# Altium project LPCB227__RLOOP__REMOTE_ACCEL.PrjPCB
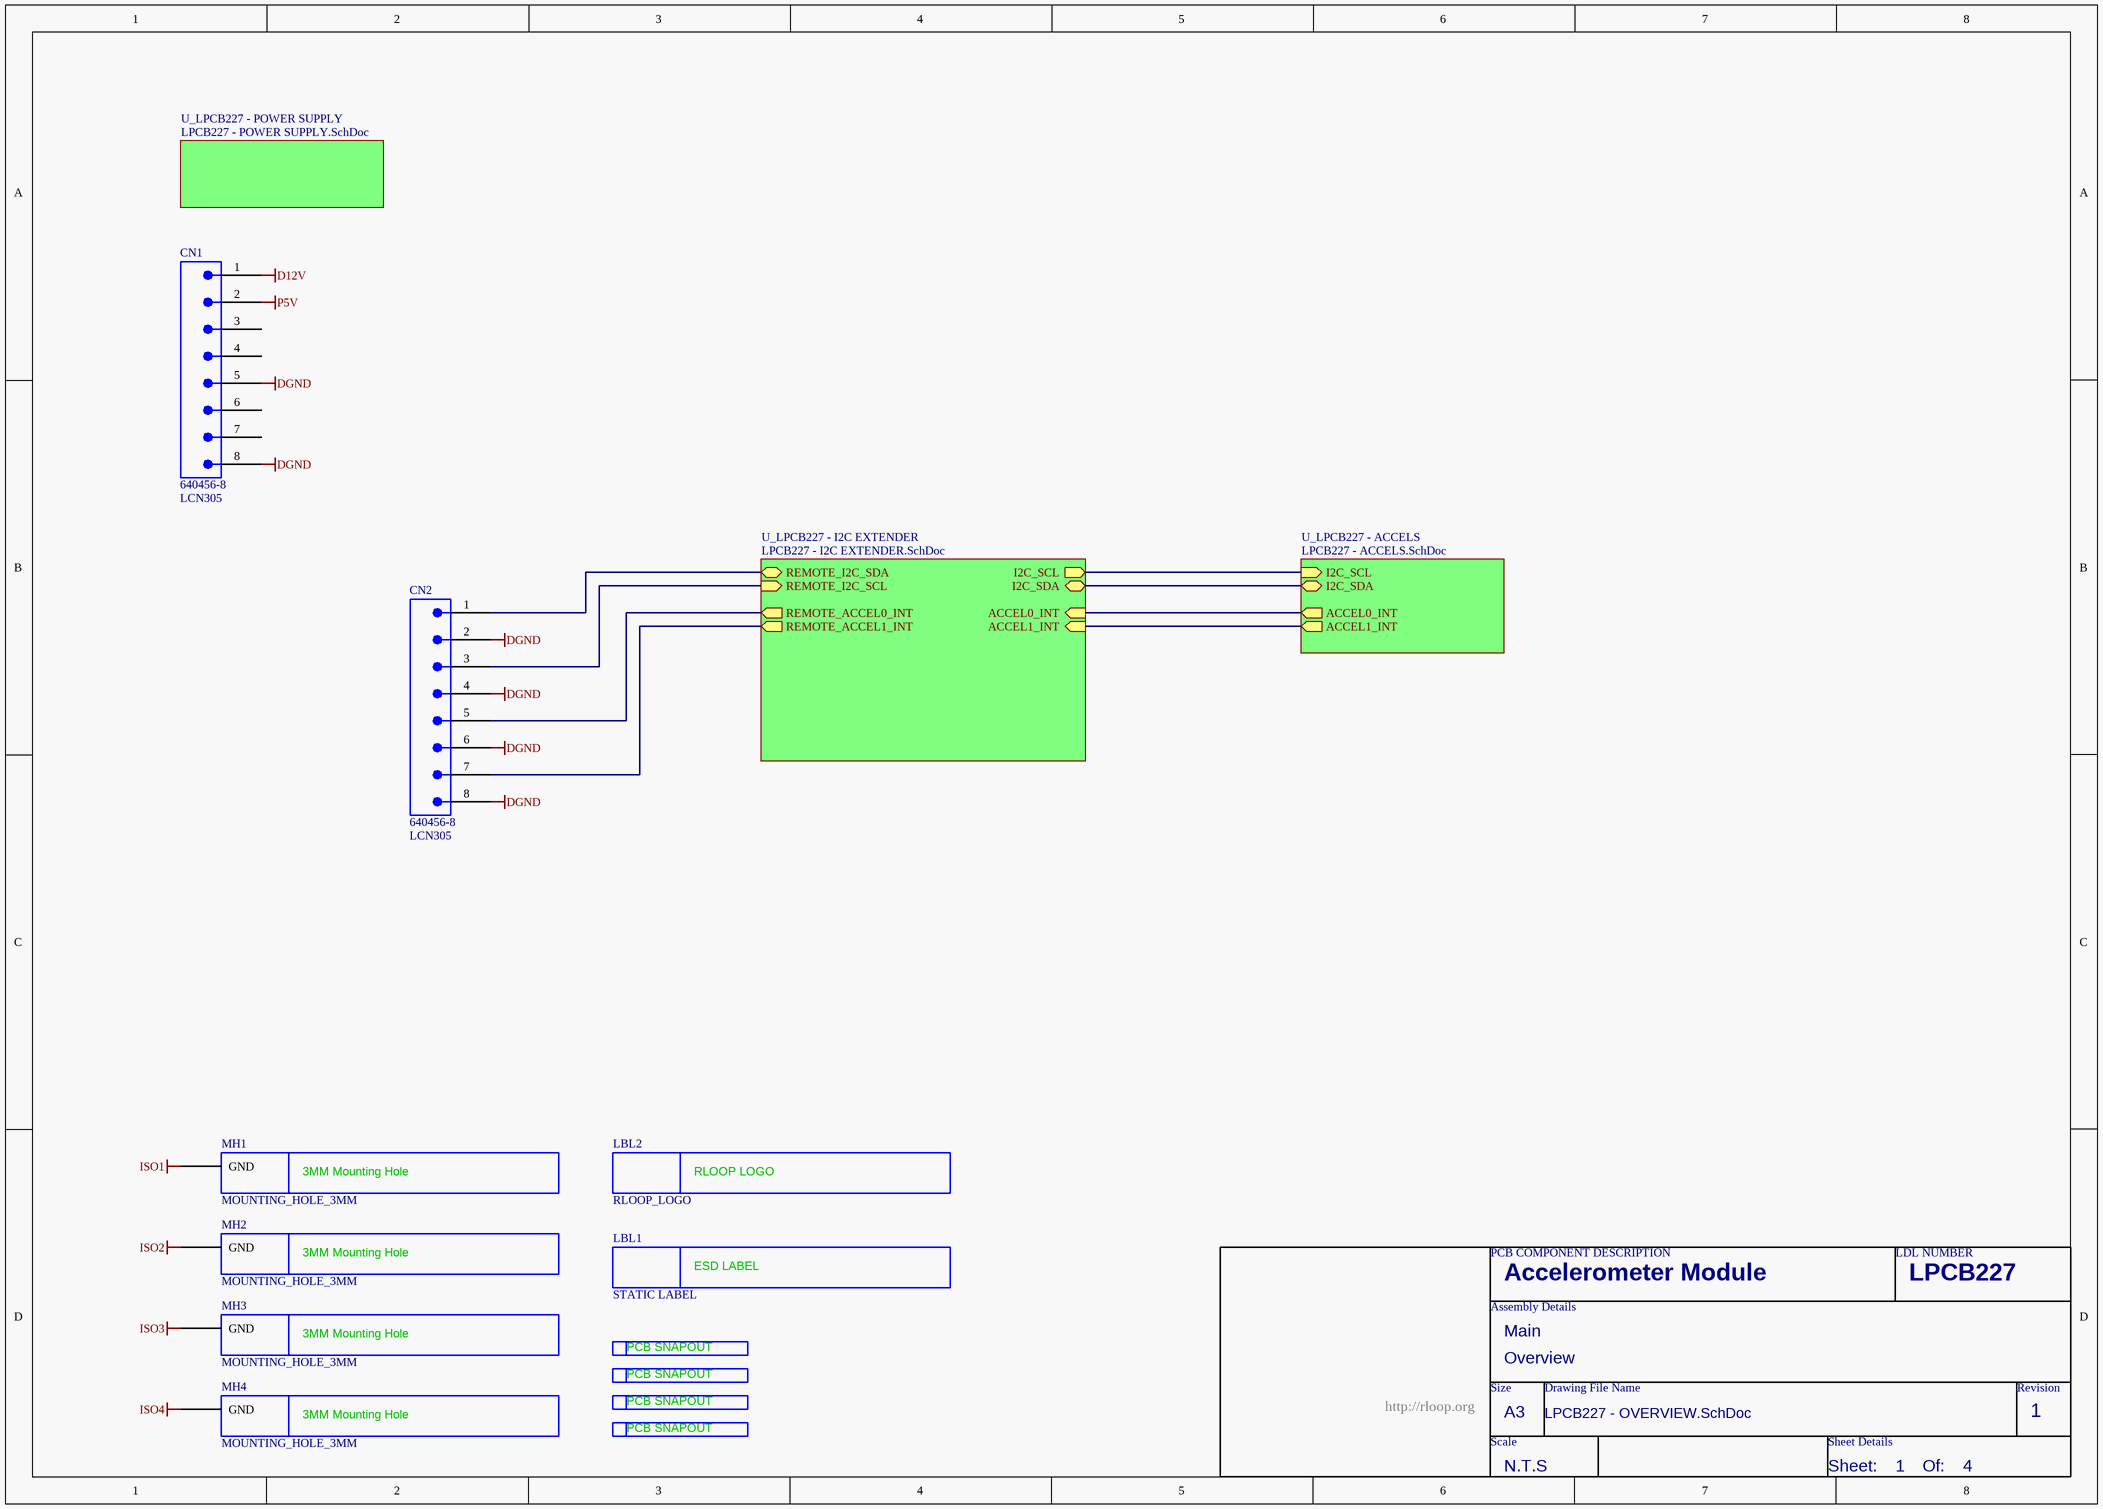
[diagram p0: LPCB227 - OVERVIEW.SchDoc]
4 sheets, 39 parts. Net scope: hierarchical (ports join the sheet entries above them; power ports are global).
Board files: LPCB227R0.PcbDoc, LPCB227R0__ASCII.PcbDoc
Sheets:
  LPCB227 - OVERVIEW.SchDoc
    U_LPCB227 - ACCELS = LPCB227 - ACCELS.SchDoc
    U_LPCB227 - POWER SUPPLY = LPCB227 - POWER SUPPLY.SchDoc
    U_LPCB227 - I2C EXTENDER = LPCB227 - I2C EXTENDER.SchDoc

## Sheet LPCB227 - OVERVIEW.SchDoc
size A3; Address1: Factory 10; Address2: 9-13 Dingley Avenue, Dandeong, VICTORIA 3175, AUSTRALIA; DocumentNumber: 1; Revision: 1; SheetNumber: 1; SheetTotal: 4; Lockie__PCB_SUB_ASSEMBLY: Overview; Lockie__PCB_ASSEMBLY: Main; Lockie__LDL: LPCB227; Lockie__PCB_DESCRIPTION: Accelerometer Module

### Parts
CN1  640456-8  LDL_NUMBER: LCN305  [640456-8]
CN2  640456-8  LDL_NUMBER: LCN305  [640456-8]
LBL1  STATIC LABEL  [STATIC_LABEL]  (no BOM)
LBL2  RLOOP_LOGO  [RLOOP_LOGO]  (no BOM)
MH1  MOUNTING_HOLE_3MM  [MOUNTING_HOLE_3MM]  (no BOM)
MH2  MOUNTING_HOLE_3MM  [MOUNTING_HOLE_3MM]  (no BOM)
MH3  MOUNTING_HOLE_3MM  [MOUNTING_HOLE_3MM]  (no BOM)
MH4  MOUNTING_HOLE_3MM  [MOUNTING_HOLE_3MM]  (no BOM)
SN1  PCB_SNAPOUT  [SNAPOUT_NEW]  (value not drawn)  (no BOM)
SN2  PCB_SNAPOUT  [SNAPOUT_NEW]  (value not drawn)  (no BOM)
SN3  PCB_SNAPOUT  [SNAPOUT_NEW]  (value not drawn)  (no BOM)
SN4  PCB_SNAPOUT  [SNAPOUT_NEW]  (value not drawn)  (no BOM)

### Sub-sheets
U_LPCB227 - ACCELS = LPCB227 - ACCELS.SchDoc: I2C_SCL (in), I2C_SDA (bidir), ACCEL0_INT (out), ACCEL1_INT (out)
U_LPCB227 - I2C EXTENDER = LPCB227 - I2C EXTENDER.SchDoc: REMOTE_I2C_SDA (bidir), REMOTE_I2C_SCL (in), I2C_SCL (out), I2C_SDA (bidir), ACCEL0_INT (in), ACCEL1_INT (in), REMOTE_ACCEL0_INT (out), REMOTE_ACCEL1_INT (out)
U_LPCB227 - POWER SUPPLY = LPCB227 - POWER SUPPLY.SchDoc: no entries

### Nets
D12V: CN1.1
DGND: CN1.5 CN1.8 CN2.2 CN2.4 CN2.6 CN2.8
ISO1: MH1.MOUNT(GND)
ISO2: MH2.MOUNT(GND)
ISO3: MH3.MOUNT(GND)
ISO4: MH4.MOUNT(GND)
P5V: CN1.2
I2C_SCL: sheet U_LPCB227 - ACCELS/I2C_SCL, sheet U_LPCB227 - I2C EXTENDER/I2C_SCL
I2C_SDA: sheet U_LPCB227 - ACCELS/I2C_SDA, sheet U_LPCB227 - I2C EXTENDER/I2C_SDA
NetCN2_1: CN2.1 ; sheet U_LPCB227 - I2C EXTENDER/REMOTE_I2C_SDA
NetCN2_3: CN2.3 ; sheet U_LPCB227 - I2C EXTENDER/REMOTE_I2C_SCL
NetCN2_5: CN2.5 ; sheet U_LPCB227 - I2C EXTENDER/REMOTE_ACCEL0_INT
NetCN2_7: CN2.7 ; sheet U_LPCB227 - I2C EXTENDER/REMOTE_ACCEL1_INT
NetIC1_11: sheet U_LPCB227 - ACCELS/ACCEL0_INT, sheet U_LPCB227 - I2C EXTENDER/ACCEL0_INT
NetIC2_11: sheet U_LPCB227 - ACCELS/ACCEL1_INT, sheet U_LPCB227 - I2C EXTENDER/ACCEL1_INT

Not connected (* = marked no-connect by the designer): CN1 3 4 6 7

### Notes on the sheet
- PCB COMPONENT DESCRIPTION
- LDL NUMBER
- Assembly Details
- Size
- Drawing File Name
- Revision
- http://rloop.org
- Scale
- A3
- Sheet Details
- N.T.S
- Sheet:
- Of:
- (in symbol MOUNTING_HOLE_3MM) 3MM Mounting Hole
- (in symbol PCB_SNAPOUT) PCB SNAPOUT
- (in symbol RLOOP_LOGO) RLOOP LOGO
- (in symbol STATIC LABEL) ESD LABEL

### Library data of the parts
CN1 CN2 = 640456-8: Connector, Male Header, 8 Way; FMEDA__CHANNEL: COM; FMEDA__OPERATING__CURRENT_MAX: 0; FMEDA__OPERATING__TEMP_MAX: 50; FMEDA__OPERATING__TEMP_MIN: -20; FMEDA__OPERATING__TEMP_TYP: 27; FMEDA__OPERATING__VOLTAGE_MAX: 16; FMEDA__OPERATING__VOLTAGE_TYP: 12; FMEDA__FUNCTION_IN_SYSTEM: *; FMEDA__OPERATING__CURRENT_MIN: 0; FMEDA__OPERATING__CURRENT_TYP: 0; FMEDA__OPERATING__VOLTAGE_MIN: 0
LBL1 = STATIC LABEL: FMEDA__CHANNEL: DIAG; FMEDA__FUNCTION_IN_SYSTEM: *
LBL2 = RLOOP_LOGO: FMEDA__CHANNEL: DIAG; FMEDA__FUNCTION_IN_SYSTEM: *
MH1-MH4 = MOUNTING_HOLE_3MM: 3MM Mouting Hole; FMEDA__CHANNEL: DIAG; FMEDA__FUNCTION_IN_SYSTEM: *
SN1-SN4 = PCB_SNAPOUT: FMEDA__CHANNEL: DIAG; FMEDA__FUNCTION_IN_SYSTEM: *

## Sheet LPCB227 - ACCELS.SchDoc
size A3; Address1: Factory 10; Address2: 9-13 Dingley Avenue, Dandeong, VICTORIA 3175, AUSTRALIA; DocumentNumber: 2; Revision: 1; SheetNumber: 2; SheetTotal: 4; Lockie__PCB_SUB_ASSEMBLY: Accelerometers; Lockie__PCB_ASSEMBLY: Main; Lockie__LDL: LPCB227; Lockie__PCB_DESCRIPTION: Accelerometer Module
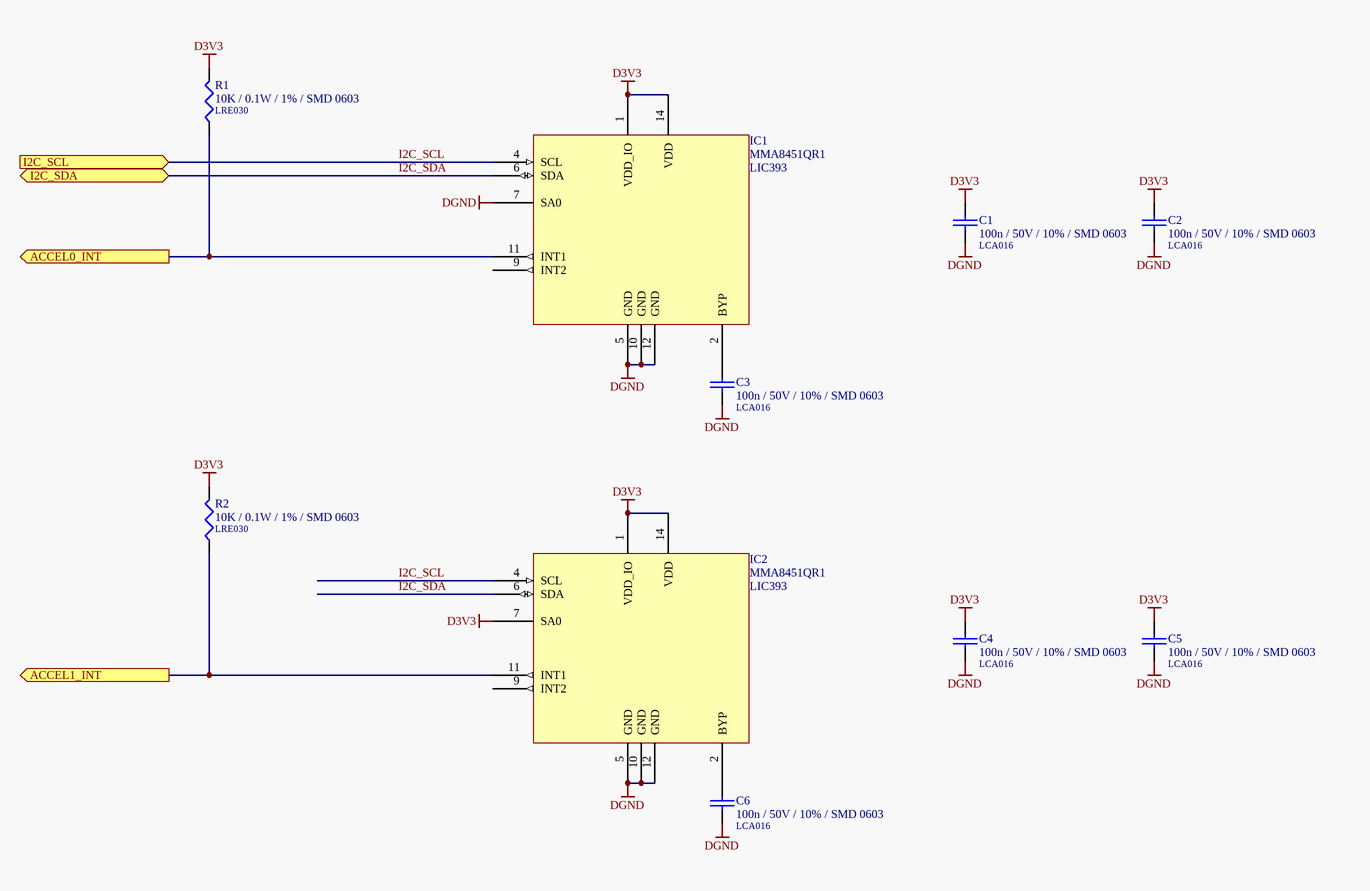
[diagram p1: LPCB227 - ACCELS.SchDoc]

### Parts
C1  100n / 50V / 10% / SMD 0603  LDL_NUMBER: LCA016  [LFP011__CC1608-0603-IPC7351_B]
C2  100n / 50V / 10% / SMD 0603  LDL_NUMBER: LCA016  [LFP011__CC1608-0603-IPC7351_B]
C3  100n / 50V / 10% / SMD 0603  LDL_NUMBER: LCA016  [LFP011__CC1608-0603-IPC7351_B]
C4  100n / 50V / 10% / SMD 0603  LDL_NUMBER: LCA016  [LFP011__CC1608-0603-IPC7351_B]
C5  100n / 50V / 10% / SMD 0603  LDL_NUMBER: LCA016  [LFP011__CC1608-0603-IPC7351_B]
C6  100n / 50V / 10% / SMD 0603  LDL_NUMBER: LCA016  [LFP011__CC1608-0603-IPC7351_B]
IC1  MMA8451QR1  LDL_NUMBER: LIC393  [LFP051__QFN16]
IC2  MMA8451QR1  LDL_NUMBER: LIC393  [LFP051__QFN16]
R1  10K / 0.1W / 1% / SMD 0603  LDL_NUMBER: LRE030  [LFP020__CR1608-0603-IPC7351_B]
R2  10K / 0.1W / 1% / SMD 0603  LDL_NUMBER: LRE030  [LFP020__CR1608-0603-IPC7351_B]

### Ports
ACCEL0_INT (out), ACCEL1_INT (out), I2C_SCL (in), I2C_SDA (bidir)

### Nets
D3V3: C1.1 C2.1 C4.1 C5.1 IC1.1(VDD_IO) IC1.14(VDD) IC2.1(VDD_IO) IC2.7(SA0) IC2.14(VDD) R1.2 R2.2
DGND: C1.2 C2.2 C3.2 C4.2 C5.2 C6.2 IC1.5(GND) IC1.7(SA0) IC1.10(GND) IC1.12(GND) IC2.5(GND) IC2.10(GND) IC2.12(GND)
I2C_SCL: IC1.4(SCL) IC2.4(SCL) ; port I2C_SCL
I2C_SDA: IC1.6(SDA) IC2.6(SDA) ; port I2C_SDA
NetC3_1: C3.1 IC1.2(BYP)
NetC6_1: C6.1 IC2.2(BYP)
NetIC1_11: IC1.11(INT1) R1.1 ; port ACCEL0_INT
NetIC2_11: IC2.11(INT1) R2.1 ; port ACCEL1_INT

Not connected (* = marked no-connect by the designer): IC1 9(INT2); IC2 9(INT2)

### Notes on the sheet
- PCB COMPONENT DESCRIPTION
- LDL NUMBER
- Assembly Details
- Size
- Drawing File Name
- Revision
- http://rloop.org
- Scale
- A3
- Sheet Details
- N.T.S
- Sheet:
- Of:

### Library data of the parts
C1-C6 = 100n / 50V / 10% / SMD 0603: Capacitor, Ceramic Chip, 100nF (0.1uF), 50V, 5%, SMD 0603 [LCA016]; FMEDA__OPERATING__VOLTAGE_MIN: 0; FMEDA__OPERATING__VOLTAGE_MAX: 3.3; FMEDA__OPERATING__TEMP_MIN: -20; FMEDA__OPERATING__TEMP_TYP: 27; FMEDA__OPERATING__TEMP_MAX: 50; FMEDA__CHANNEL: COM; Value: 100n; FMEDA__FUNCTION_IN_SYSTEM: *; FMEDA__OPERATING__VOLTAGE_TYP: 3.3
IC1 IC2 = MMA8451QR1: IC, Accelerometer, 3-Axis, 3.3V, I2C, SMD QFN16 [LIC393]; FMEDA__OPERATING__TEMP_MAX: 50; FMEDA__OPERATING__TEMP_MIN: -20; FMEDA__OPERATING__TEMP_TYP: 27; FMEDA__OPERATING__VOLTAGE_MAX: 3.3; FMEDA__OPERATING__VOLTAGE_MIN: 0; FMEDA__CHANNEL: COM; FMEDA__OPERATING__VOLTAGE_TYP: 3.3; FMEDA__FUNCTION_IN_SYSTEM: *
R1 R2 = 10K / 0.1W / 1% / SMD 0603: Resistor, Ceramic Chip, 10K, 0.1W, 1%, SMD 0603 [LRE030]; FMEDA__OPERATING__POWER_MAX: 0; FMEDA__OPERATING__TEMP_MAX: 50; FMEDA__OPERATING__TEMP_MIN: -20; FMEDA__OPERATING__TEMP_TYP: 27; FMEDA__CHANNEL: COM; Value: 10K; FMEDA__OPERATING__POWER_MIN: 0; FMEDA__OPERATING__VOLTAGE_MAX: 0; FMEDA__OPERATING__VOLTAGE_MIN: 0; FMEDA__OPERATING__VOLTAGE_TYP: 0; FMEDA__FUNCTION_IN_SYSTEM: *

## Sheet LPCB227 - POWER SUPPLY.SchDoc
size A3; Address1: Factory 10; Address2: 9-13 Dingley Avenue, Dandeong, VICTORIA 3175, AUSTRALIA; DocumentNumber: 4; Revision: 1; SheetNumber: 4; SheetTotal: 4; Lockie__PCB_SUB_ASSEMBLY: Power Supply; Lockie__PCB_ASSEMBLY: Main; Lockie__LDL: LPCB227; Lockie__PCB_DESCRIPTION: Accelerometer Module
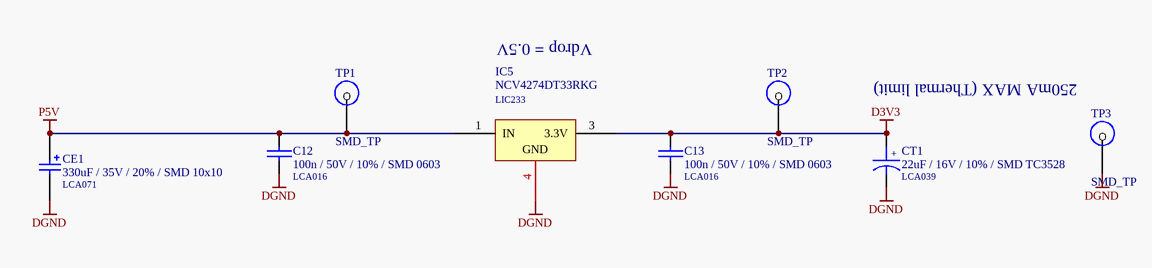
[diagram p2: LPCB227 - POWER SUPPLY.SchDoc]

### Parts
C12  100n / 50V / 10% / SMD 0603  LDL_NUMBER: LCA016  [LFP011__CC1608-0603-IPC7351_B]
C13  100n / 50V / 10% / SMD 0603  LDL_NUMBER: LCA016  [LFP011__CC1608-0603-IPC7351_B]
CE1  330uF / 35V / 20% / SMD 10x10  LDL_NUMBER: LCA071  [LFP041__NICHICON_WT_10X10]
CT1  22uF / 16V / 10% / SMD TC3528  LDL_NUMBER: LCA039  [LFP018__TC3528]
IC5  NCV4274DT33RKG  LDL_NUMBER: LIC233  [LFP019__369A-13]
TP1  SMD_TP  [SMD-TP]  (no BOM)
TP2  SMD_TP  [SMD-TP]  (no BOM)
TP3  SMD_TP  [SMD-TP]  (no BOM)

### Nets
D3V3: C13.1 CT1.1 IC5.3(3.3V) TP2.1
DGND: C12.2 C13.2 CE1.2 CT1.2 IC5.4(GND) TP3.1
P5V: C12.1 CE1.1 IC5.1(IN) TP1.1

### Notes on the sheet
- Vdrop = 0.5V
- 250mA MAX (Thermal limit)
- PCB COMPONENT DESCRIPTION
- LDL NUMBER
- Assembly Details
- Size
- Drawing File Name
- Revision
- http://rloop.org
- Scale
- A3
- Sheet Details
- N.T.S
- Sheet:
- Of:
- (in symbol 22uF / 16V / 10% / SMD TC3528) +

### Library data of the parts
C12 C13 = 100n / 50V / 10% / SMD 0603: as C1 on sheet LPCB227 - ACCELS; Value: 100n; FMEDA__FUNCTION_IN_SYSTEM: *; FMEDA__OPERATING__VOLTAGE_TYP: 3.3
CE1 = 330uF / 35V / 20% / SMD 10x10: Capacitor, Aluminum Electrolytic, 330uF, 35V, 20%, SMD (10mm x 10mm) [LCA071]; FMEDA__OPERATING__TEMP_MAX: 50; FMEDA__OPERATING__TEMP_MIN: -20; FMEDA__OPERATING__TEMP_TYP: 27; FMEDA__OPERATING__VOLTAGE_MAX: 0; Value: 330u; FMEDA__CHANNEL: COM; FMEDA__OPERATING__VOLTAGE_MIN: 0; FMEDA__OPERATING__VOLTAGE_TYP: 0; FMEDA__FUNCTION_IN_SYSTEM: *
CT1 = 22uF / 16V / 10% / SMD TC3528: Capacitor, Tantalum, 22uF, 16V, 10%, SMD TC3528 (BCASE) [LCA039]; Value: 22u; FMEDA__OPERATING__VOLTAGE_MAX: 3.3; FMEDA__OPERATING__VOLTAGE_MIN: 0; FMEDA__OPERATING__TEMP_MAX: 50; FMEDA__OPERATING__TEMP_MIN: -20; FMEDA__OPERATING__TEMP_TYP: 27; FMEDA__CHANNEL: COM; FMEDA__OPERATING__VOLTAGE_TYP: 3.3; FMEDA__FUNCTION_IN_SYSTEM: *
IC5 = NCV4274DT33RKG: IC, Voltage Regulator, 400mA, 3.3V LDO, SMD DPAK [LIC233]; FMEDA__OPERATING__OUTPUT_CURRENT_MIN: 0; FMEDA__OPERATING__TEMP_MAX: 50; FMEDA__OPERATING__TEMP_MIN: -20; FMEDA__OPERATING__TEMP_TYP: 27; VALUE: 0; Note: Obey Thermal Design Rules; FMEDA__CHANNEL: COM; FMEDA__OPERATING__OUTPUT_CURRENT_TYP: 0; FMEDA__OPERATING__VOLTAGE_MAX: 0; FMEDA__OPERATING__VOLTAGE_MIN: 0; FMEDA__OPERATING__VOLTAGE_TYP: 0; FMEDA__FUNCTION_IN_SYSTEM: *
TP1-TP3 = SMD_TP: SMD Test Point; FMEDA__CHANNEL: COM; FMEDA__OPERATING__CURRENT_MAX: 0; FMEDA__OPERATING__TEMP_MAX: 50; FMEDA__OPERATING__TEMP_MIN: -20; FMEDA__OPERATING__TEMP_TYP: 27; FMEDA__OPERATING__VOLTAGE_MAX: 16; FMEDA__OPERATING__VOLTAGE_TYP: 12; FMEDA__OPERATING__CURRENT_MIN: 0; FMEDA__OPERATING__CURRENT_TYP: 0; FMEDA__OPERATING__VOLTAGE_MIN: 0

## Sheet LPCB227 - I2C EXTENDER.SchDoc
size A3; Address1: Factory 10; Address2: 9-13 Dingley Avenue, Dandeong, VICTORIA 3175, AUSTRALIA; DocumentNumber: 3; Revision: 1; SheetNumber: 3; SheetTotal: 4; Lockie__PCB_SUB_ASSEMBLY: Bus Extender; Lockie__PCB_ASSEMBLY: Main; Lockie__LDL: LPCB227; Lockie__PCB_DESCRIPTION: Accelerometer Module
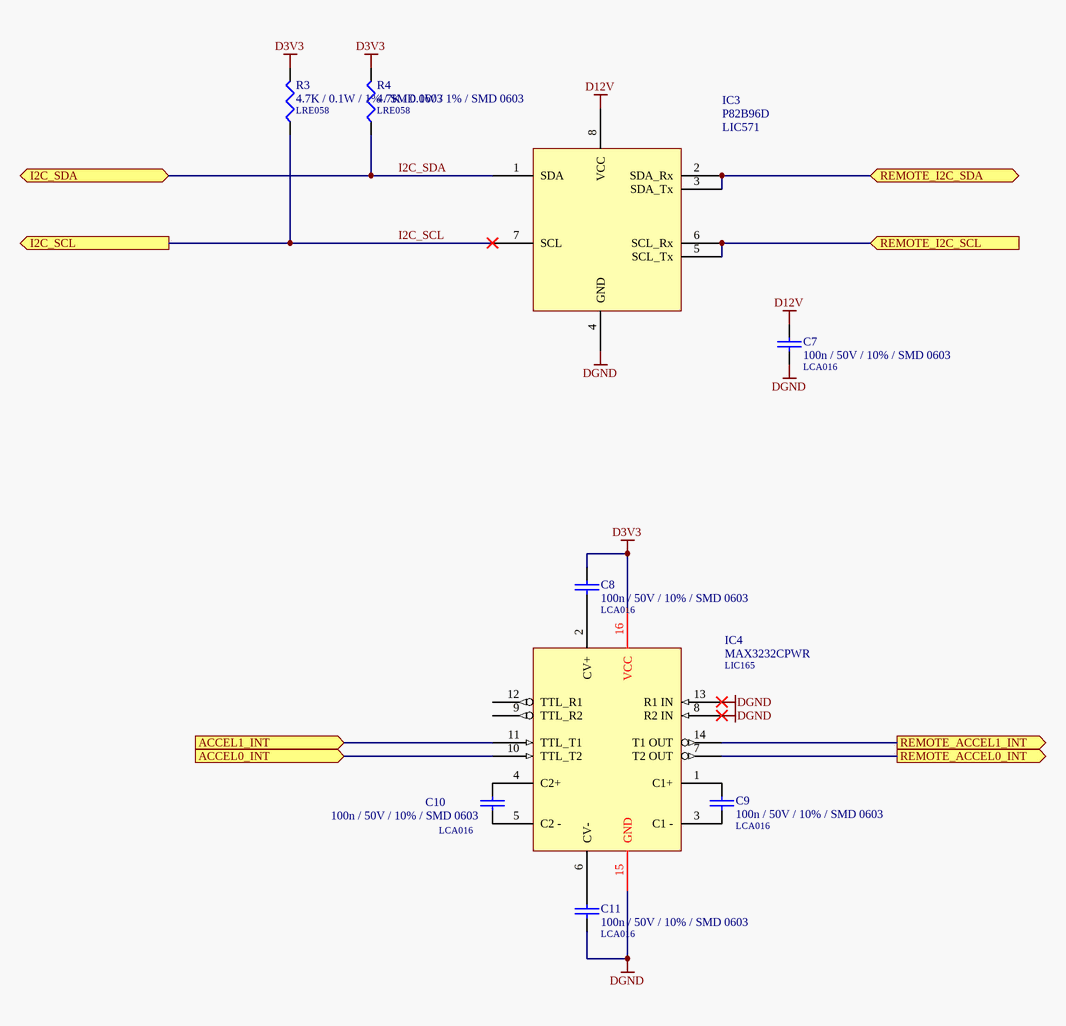
[diagram p3: LPCB227 - I2C EXTENDER.SchDoc]

### Parts
C7  100n / 50V / 10% / SMD 0603  LDL_NUMBER: LCA016  [LFP011__CC1608-0603-IPC7351_B]
C8  100n / 50V / 10% / SMD 0603  LDL_NUMBER: LCA016  [LFP011__CC1608-0603-IPC7351_B]
C9  100n / 50V / 10% / SMD 0603  LDL_NUMBER: LCA016  [LFP011__CC1608-0603-IPC7351_B]
C10  100n / 50V / 10% / SMD 0603  LDL_NUMBER: LCA016  [LFP011__CC1608-0603-IPC7351_B]
C11  100n / 50V / 10% / SMD 0603  LDL_NUMBER: LCA016  [LFP011__CC1608-0603-IPC7351_B]
IC3  P82B96D  LDL_NUMBER: LIC571  [LFP097__SOIC150-8]
IC4  MAX3232CPWR  LDL_NUMBER: LIC165  [LFP049__TSSOP-16]
R3  4.7K / 0.1W / 1% / SMD 0603  LDL_NUMBER: LRE058  [LFP020__CR1608-0603-IPC7351_B]
R4  4.7K / 0.1W / 1% / SMD 0603  LDL_NUMBER: LRE058  [LFP020__CR1608-0603-IPC7351_B]

### Ports
ACCEL0_INT (in), ACCEL1_INT (in), I2C_SCL (out), I2C_SDA (bidir), REMOTE_ACCEL0_INT (out), REMOTE_ACCEL1_INT (out), REMOTE_I2C_SCL (in), REMOTE_I2C_SDA (bidir)

### Nets
D3V3: C8.1 IC4.16(VCC) R3.2 R4.2
D12V: C7.1 IC3.8(VCC)
DGND: C7.2 C11.2 IC3.4(GND) IC4.8(R2_IN) IC4.13(R1_IN) IC4.15(GND)
I2C_SCL: IC3.7(SCL) R3.1 ; port I2C_SCL
I2C_SDA: IC3.1(SDA) R4.1 ; port I2C_SDA
NetC8_2: C8.2 IC4.2(CV+)
NetC9_1: C9.1 IC4.1(C1+)
NetC9_2: C9.2 IC4.3(C1_-)
NetC10_1: C10.1 IC4.4(C2+)
NetC10_2: C10.2 IC4.5(C2_-)
NetC11_1: C11.1 IC4.6(CV-)
NetCN2_1: IC3.2(SDA_Rx) IC3.3(SDA_Tx) ; port REMOTE_I2C_SDA
NetCN2_3: IC3.5(SCL_Tx) IC3.6(SCL_Rx) ; port REMOTE_I2C_SCL
NetCN2_5: IC4.7(T2_OUT) ; port REMOTE_ACCEL0_INT
NetCN2_7: IC4.14(T1_OUT) ; port REMOTE_ACCEL1_INT
NetIC1_11: IC4.10(TTL_T2) ; port ACCEL0_INT
NetIC2_11: IC4.11(TTL_T1) ; port ACCEL1_INT

Not connected (* = marked no-connect by the designer): IC4 9(TTL_R2) 12(TTL_R1)

### Notes on the sheet
- PCB COMPONENT DESCRIPTION
- LDL NUMBER
- Assembly Details
- Size
- Drawing File Name
- Revision
- http://rloop.org
- Scale
- A3
- Sheet Details
- N.T.S
- Sheet:
- Of:

### Library data of the parts
C7 = 100n / 50V / 10% / SMD 0603: as C1 on sheet LPCB227 - ACCELS; Value: 100n; FMEDA__FUNCTION_IN_SYSTEM: *; FMEDA__OPERATING__VOLTAGE_TYP: 3.3
C8-C11 = 100n / 50V / 10% / SMD 0603: Capacitor, Ceramic Chip, 100nF, 50V, 10%, SMD 0603; FMEDA__OPERATING__VOLTAGE_MIN: 0; FMEDA__OPERATING__VOLTAGE_MAX: 3.3; FMEDA__OPERATING__TEMP_MIN: -20; FMEDA__OPERATING__TEMP_TYP: 27; FMEDA__OPERATING__TEMP_MAX: 50; FMEDA__CHANNEL: COM; Value: 100n; FMEDA__FUNCTION_IN_SYSTEM: *; FMEDA__OPERATING__VOLTAGE_TYP: 3.3
IC3 = P82B96D: IC, I2C Line Driver [LIC571]
IC4 = MAX3232CPWR: IC, RS232 Line Driver, 3.3V, SMD TSSOP16; FMEDA__OPERATING__TEMP_MAX: 50; FMEDA__OPERATING__TEMP_MIN: -20; FMEDA__OPERATING__TEMP_TYP: 27; FMEDA__CHANNEL: COM; FMEDA__OPERATING__VOLTAGE_MAX: 3.3; FMEDA__OPERATING__VOLTAGE_MIN: 0; FMEDA__FUNCTION_IN_SYSTEM: *; FMEDA__OPERATING__VOLTAGE_TYP: 3.3
R3 R4 = 4.7K / 0.1W / 1% / SMD 0603: Resistor, Ceramic Chip, 4K7, 0.1W, 1%, SMD 0603 [LRE058]; FMEDA__OPERATING__POWER_MAX: 0; FMEDA__OPERATING__TEMP_MAX: 50; FMEDA__OPERATING__TEMP_MIN: -20; FMEDA__OPERATING__TEMP_TYP: 27; FMEDA__CHANNEL: COM; VALUE: 4.7K; FMEDA__OPERATING__POWER_MIN: 0; FMEDA__OPERATING__VOLTAGE_MAX: 0; FMEDA__OPERATING__VOLTAGE_MIN: 0; FMEDA__OPERATING__VOLTAGE_TYP: 0; FMEDA__FUNCTION_IN_SYSTEM: *

## Nets that join several sheets
D3V3: LPCB227 - ACCELS (11 pins), LPCB227 - POWER SUPPLY (C13.1 CT1.1 IC5.3 TP2.1), LPCB227 - I2C EXTENDER (C8.1 IC4.16 R3.2 R4.2)
D12V: LPCB227 - OVERVIEW (CN1.1), LPCB227 - I2C EXTENDER (C7.1 IC3.8)
DGND: LPCB227 - OVERVIEW (6 pins), LPCB227 - ACCELS (13 pins), LPCB227 - POWER SUPPLY (6 pins), LPCB227 - I2C EXTENDER (6 pins)
P5V: LPCB227 - OVERVIEW (CN1.2), LPCB227 - POWER SUPPLY (C12.1 CE1.1 IC5.1 TP1.1)
I2C_SCL: LPCB227 - ACCELS (IC1.4 IC2.4), LPCB227 - I2C EXTENDER (IC3.7 R3.1)
I2C_SDA: LPCB227 - ACCELS (IC1.6 IC2.6), LPCB227 - I2C EXTENDER (IC3.1 R4.1)
NetCN2_1: LPCB227 - OVERVIEW (CN2.1), LPCB227 - I2C EXTENDER (IC3.2 IC3.3)
NetCN2_3: LPCB227 - OVERVIEW (CN2.3), LPCB227 - I2C EXTENDER (IC3.5 IC3.6)
NetCN2_5: LPCB227 - OVERVIEW (CN2.5), LPCB227 - I2C EXTENDER (IC4.7)
NetCN2_7: LPCB227 - OVERVIEW (CN2.7), LPCB227 - I2C EXTENDER (IC4.14)
NetIC1_11: LPCB227 - ACCELS (IC1.11 R1.1), LPCB227 - I2C EXTENDER (IC4.10)
NetIC2_11: LPCB227 - ACCELS (IC2.11 R2.1), LPCB227 - I2C EXTENDER (IC4.11)